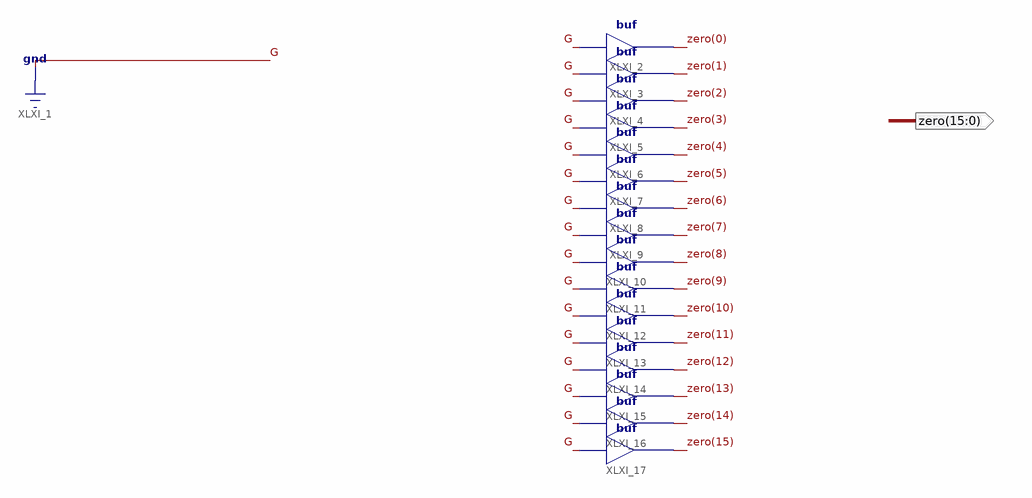
[diagram p0: schematic sheet 1]
// Xilinx ISE schematic constant0.sch (spartan3e) as structural Verilog: 16 symbols, 1 ports
module constant0 (
  output [15:0] zero
);

  buf XLXI_2 (zero[0], 1'b0);
  buf XLXI_3 (zero[1], 1'b0);
  buf XLXI_4 (zero[2], 1'b0);
  buf XLXI_5 (zero[3], 1'b0);
  buf XLXI_6 (zero[4], 1'b0);
  buf XLXI_7 (zero[5], 1'b0);
  buf XLXI_8 (zero[6], 1'b0);
  buf XLXI_9 (zero[7], 1'b0);
  buf XLXI_10 (zero[8], 1'b0);
  buf XLXI_11 (zero[9], 1'b0);
  buf XLXI_12 (zero[10], 1'b0);
  buf XLXI_13 (zero[11], 1'b0);
  buf XLXI_14 (zero[12], 1'b0);
  buf XLXI_15 (zero[13], 1'b0);
  buf XLXI_16 (zero[14], 1'b0);
  buf XLXI_17 (zero[15], 1'b0);
endmodule
